# EAGLE schematic circuito_tesi (EAGLE 9.6.2)
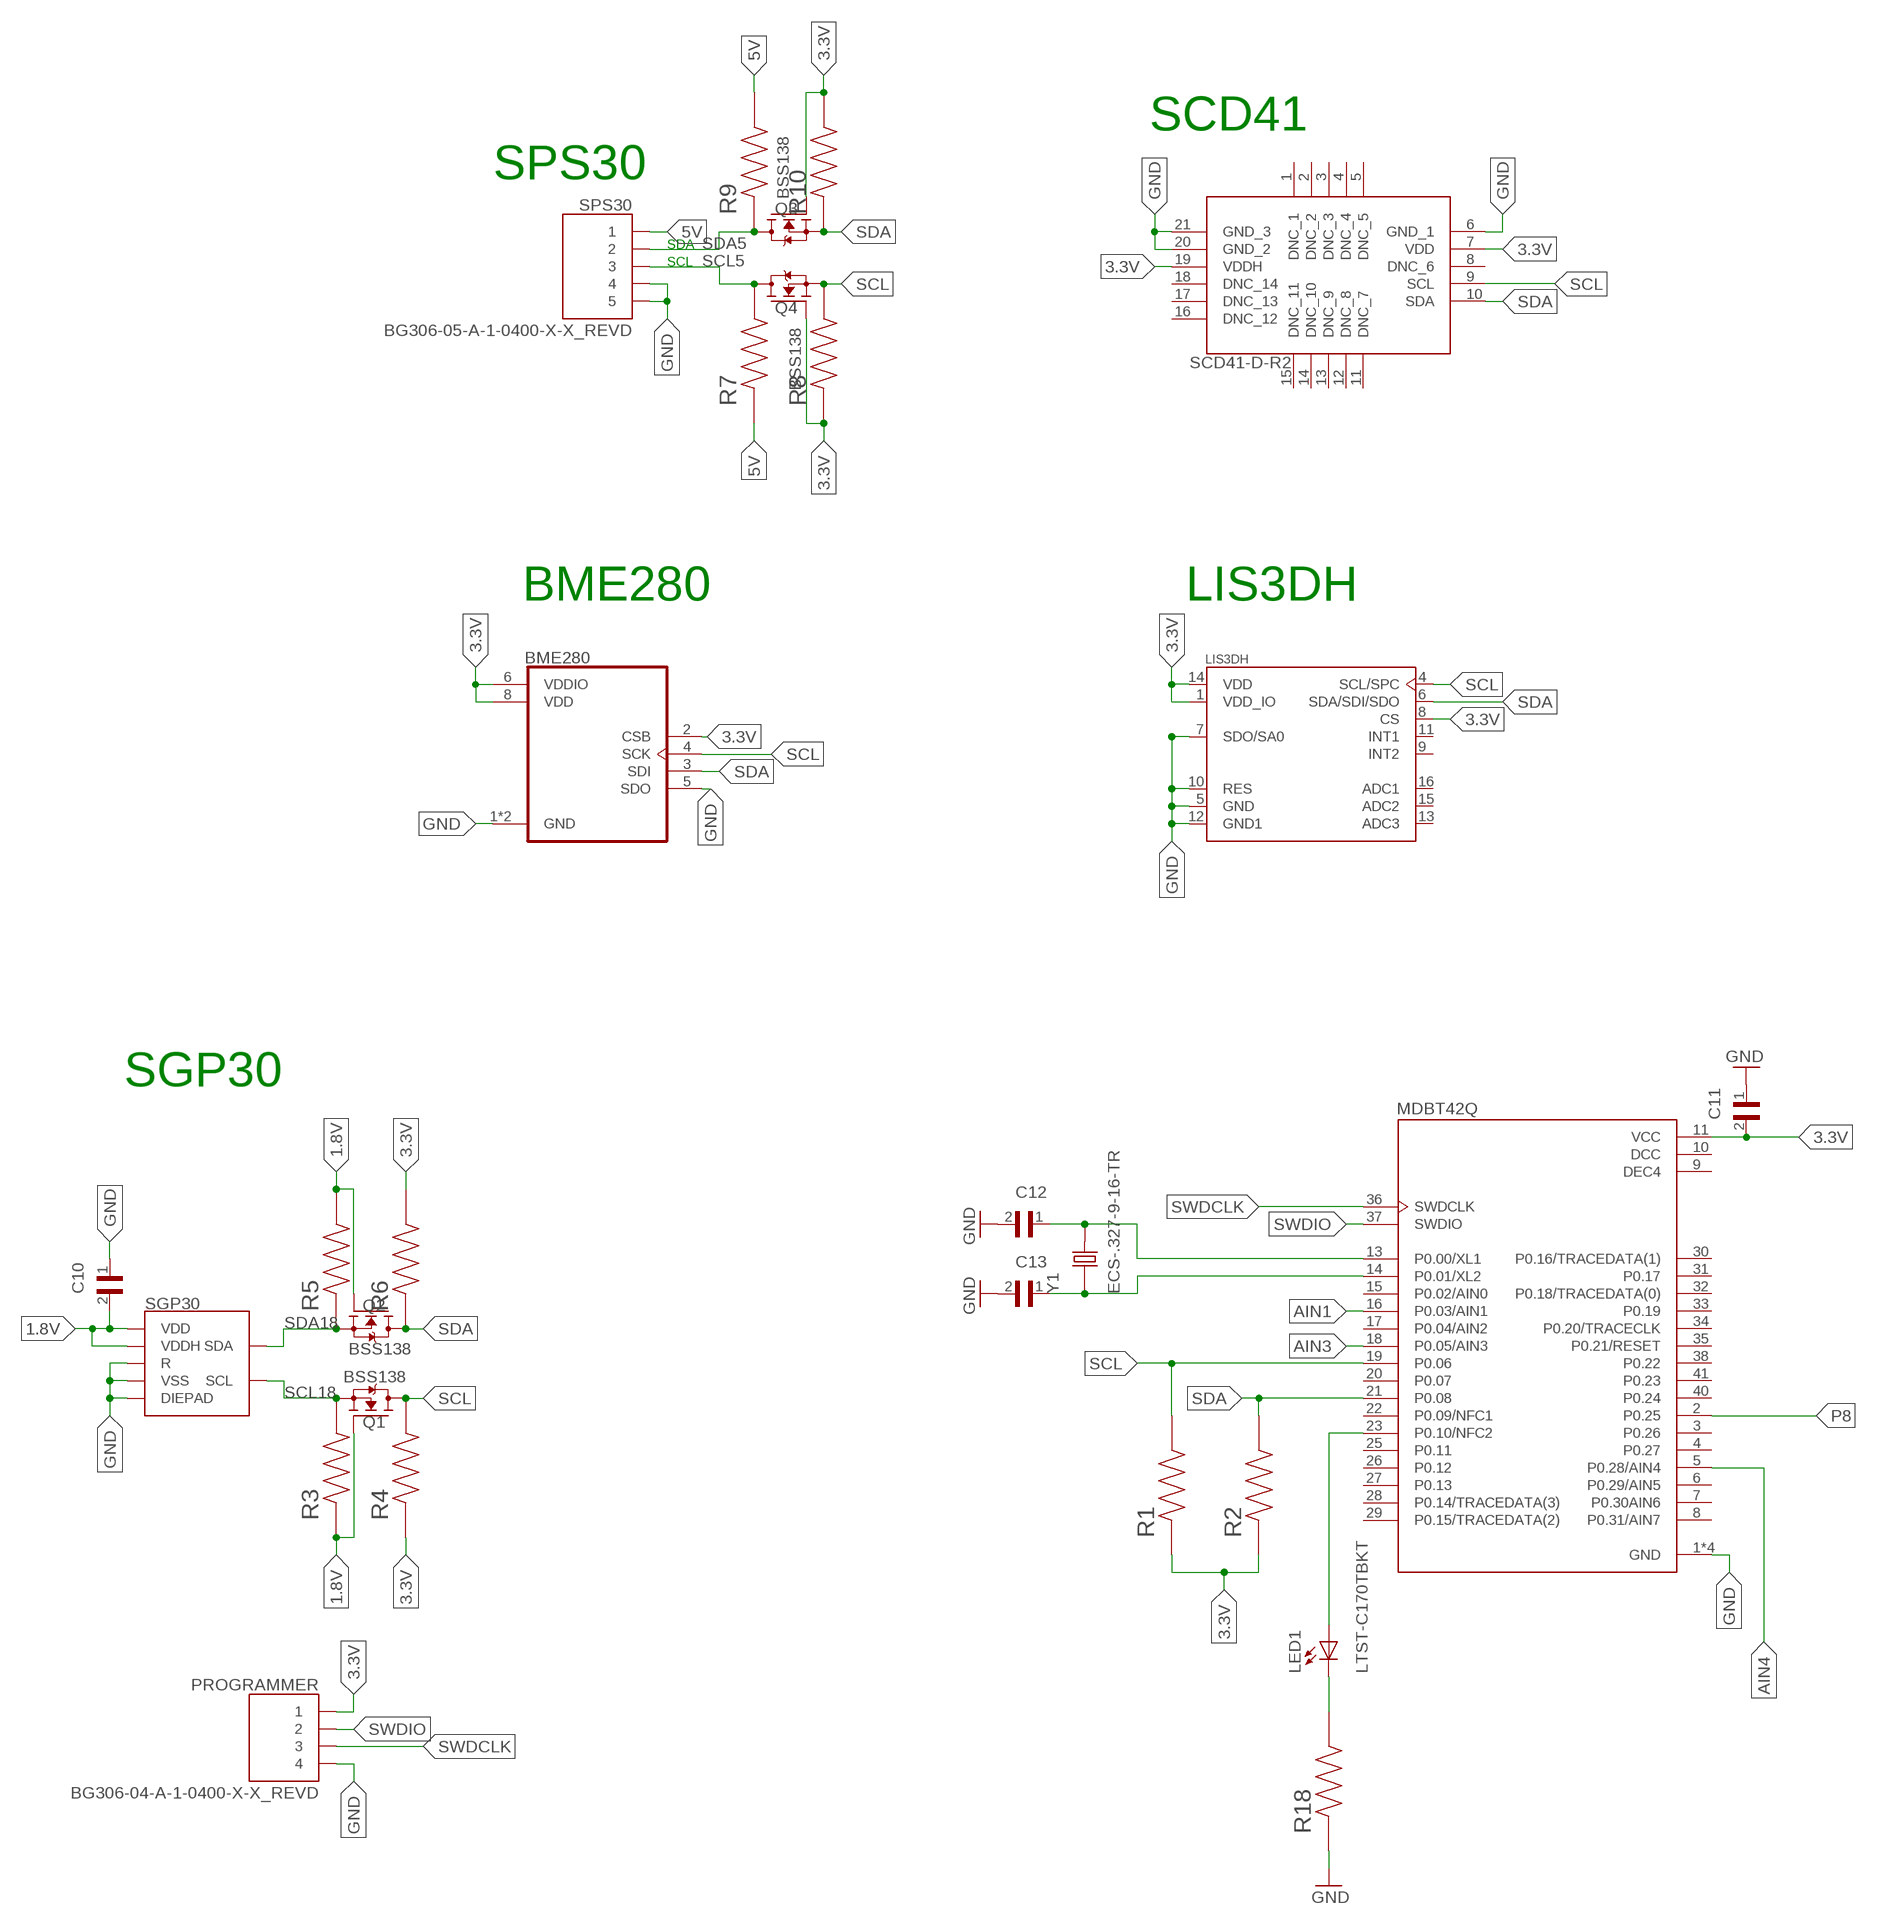
[diagram p0: schematic, sheet 1, part 1 of 2]
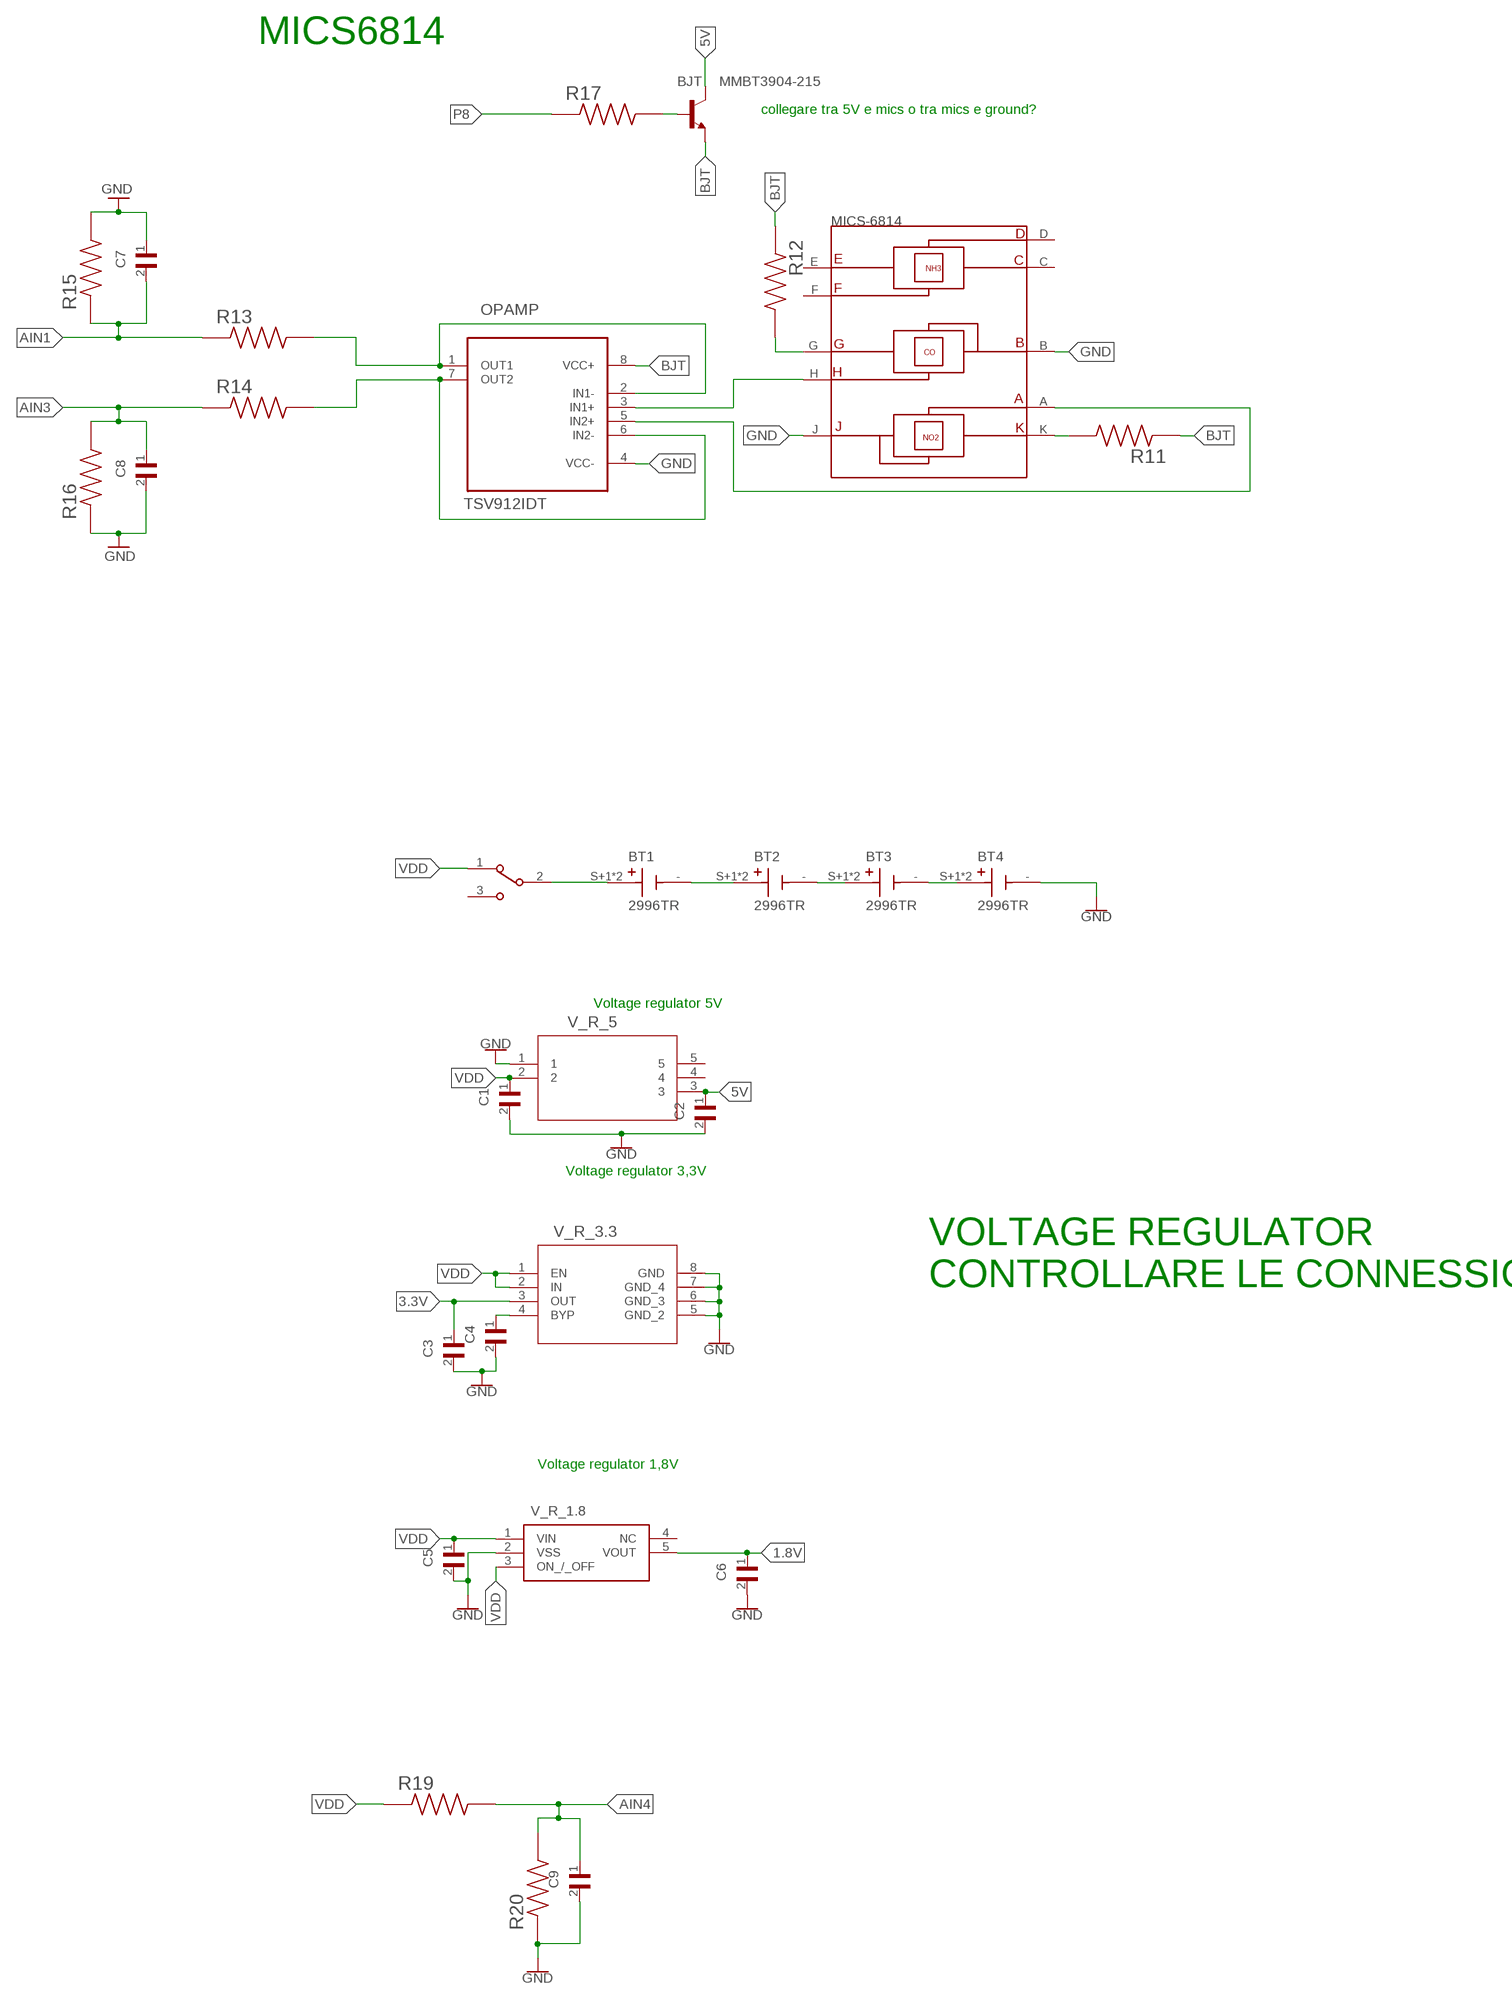
[diagram p1: schematic, sheet 1, part 2 of 2]

## Parts
BJT  MMBT3904-215  [SOT95P230X110-3N]
BT1  2996TR  [BAT_2996TR]
BT2  2996TR  [BAT_2996TR]
BT3  2996TR  [BAT_2996TR]
BT4  2996TR  [BAT_2996TR]
C1  C0402H102J5GACTU  [CAPC1005X55N]
C2  C0402H102J5GACTU  [CAPC1005X55N]
C3  C0402H102J5GACTU  [CAPC1005X55N]
C4  C0402H102J5GACTU  [CAPC1005X55N]
C5  C0402H102J5GACTU  [CAPC1005X55N]
C6  C0402H102J5GACTU  [CAPC1005X55N]
C7  C0402H102J5GACTU  [CAPC1005X55N]
C8  C0402H102J5GACTU  [CAPC1005X55N]
C9  C0402H102J5GACTU  [CAPC1005X55N]
C10  C0402H102J5GACTU  [CAPC1005X55N]
C11  C0402H102J5GACTU  [CAPC1005X55N]
C12  C0402H102J5GACTU  [CAPC1005X55N]
C13  C0402H102J5GACTU  [CAPC1005X55N]
IC1  SCD41-D-R2  [SCD41DR2]
LED1  LTST-C170TBKT  [DIOC200X125X110]
MDBT42Q  317030213  [XCVR_317030213]
OPAMP  TSV912IDT  [SOIC127P600X175-8N]
PROGRAMMER  BG306-04-A-1-0400-X-X_REVD  [GCT_BG306-04-A-1-0400-X-X_REVD]
Q1  BSS138  [SOT95P240X111-3N]
Q2  BSS138  [SOT95P240X111-3N]
Q3  BSS138  [SOT95P240X111-3N]
Q4  BSS138  [SOT95P240X111-3N]
R1  8-1879333-9  [RESC1005X35N]
R2  8-1879333-9  [RESC1005X35N]
R3  8-1879333-9  [RESC1005X35N]
R4  8-1879333-9  [RESC1005X35N]
R5  8-1879333-9  [RESC1005X35N]
R6  8-1879333-9  [RESC1005X35N]
R7  8-1879333-9  [RESC1005X35N]
R8  8-1879333-9  [RESC1005X35N]
R9  8-1879333-9  [RESC1005X35N]
R10  8-1879333-9  [RESC1005X35N]
R11  8-1879333-9  [RESC1005X35N]
R12  8-1879333-9  [RESC1005X35N]
R13  8-1879333-9  [RESC1005X35N]
R14  8-1879333-9  [RESC1005X35N]
R15  8-1879333-9  [RESC1005X35N]
R16  8-1879333-9  [RESC1005X35N]
R17  8-1879333-9  [RESC1005X35N]
R18  8-1879333-9  [RESC1005X35N]
R19  8-1879333-9  [RESC1005X35N]
R20  8-1879333-9  [RESC1005X35N]
S1  EG1213  [SW_EG1213]
SGP30  SGP30  [SGP30]
SPS30  BG306-05-A-1-0400-X-X_REVD  [GCT_BG306-05-A-1-0400-X-X_REVD]
U3  MICS-6814  [SENSOR_MICS-6814]
U6  BME280  [PSON65P250X250X100-8N]
U7  LIS3DH  [PQFN50P300X300X100-16N]
V_R_1.8  S-1318D18-M5T1U4  [SOT95P275X130-5N]
V_R_3.3  MIC5219-3.3YMMMSOP-8LD-PL-1_MCH  [MSOP-8LD-PL-1_MCH]
V_R_5  MC78LC50NTRGTSOT23-5_ONS  [TSOT23-5_ONS]
Y1  ECS-.327-9-16-TR  [XTAL_ECS-.327-9-16-TR]

## Nets
1.8V: C6.1 C10.2 Q1.1(G) Q2.1(G) R3.1 R5.2 SGP30.1(VDD) SGP30.5(VDDH) V_R_1.8.5(VOUT)
3.3V: C3.1 C11.2 IC1.7(VDD) IC1.19(VDDH) MDBT42Q.11(VCC) PROGRAMMER.1 Q3.1(G) Q4.1(G) R1.1 R2.1 R4.1 R6.2 R8.1 R10.2 U6.2(CSB) U6.6(VDDIO) U6.8(VDD) U7.1(VDD_IO) U7.8(CS) U7.14(VDD) V_R_3.3.3(OUT)
5V: BJT.3(C) C2.1 R7.1 R9.2 SPS30.1 V_R_5.3
AIN1: C7.2 MDBT42Q.16(P0.03/AIN1) R13.1 R15.1
AIN3: C8.1 MDBT42Q.18(P0.05/AIN3) R14.1 R16.2
AIN4: C9.1 MDBT42Q.5(P0.28/AIN4) R19.2 R20.2
BJT: BJT.2(E) OPAMP.8(VCC+) R11.1 R12.1
GND: BT4.- C1.2 C2.2 C3.2 C4.2 C5.2 C6.2 C7.1 C8.2 C9.2 C10.1 C11.1 C12.2 C13.2 IC1.6(GND_1) IC1.20(GND_2) IC1.21(GND_3) MDBT42Q.1(GND) MDBT42Q.12(GND) MDBT42Q.24(GND) MDBT42Q.39(GND) OPAMP.4(VCC-) PROGRAMMER.4 R15.2 R16.1 R18.1 R20.1 SGP30.2(VSS) SGP30.4(R) SGP30.DIEPAD SPS30.4 SPS30.5 U3.B(RH1/RS1_RED) U3.J(RH1/RS1_OX) U6.1(GND) U6.5(SDO) U6.7(GND) U7.5(GND) U7.7(SDO/SA0) U7.10(RES) U7.12(GND1) V_R_1.8.2(VSS) V_R_3.3.5(GND_2) V_R_3.3.6(GND_3) V_R_3.3.7(GND_4) V_R_3.3.8(GND) V_R_5.1
LED: LED1.+ MDBT42Q.23(P0.10/NFC2)
N$2: BT1.- BT2.S+1(+) BT2.S+2(+)
N$4: BT2.- BT3.S+1(+) BT3.S+2(+)
N$6: OPAMP.5(IN2+) U3.A(RS2)
N$7: OPAMP.6(IN2-) OPAMP.7(OUT2) R14.2
N$8: OPAMP.1(OUT1) OPAMP.2(IN1-) R13.2
N$9: LED1.- R18.2
N$10: OPAMP.3(IN1+) U3.H(RS2_RED)
N$11: R12.2 U3.G(RH2_RED)
N$13: R11.2 U3.K(RH2_OX)
N$14: C4.1 V_R_3.3.4(BYP)
N$15: BJT.1(B) R17.2
N$17: C12.1 MDBT42Q.13(P0.00/XL1) Y1.2
N$18: C13.1 MDBT42Q.14(P0.01/XL2) Y1.1
N$25: BT3.- BT4.S+1(+) BT4.S+2(+)
N$27: BT1.S+1(+) BT1.S+2(+) S1.2
P8: MDBT42Q.2(P0.25) R17.1
SCL: IC1.9(SCL) MDBT42Q.19(P0.06) Q1.3(D) Q4.2(S) R1.2 R4.2 R8.2 U6.4(SCK) U7.4(SCL/SPC)
SCL5: Q4.3(D) R7.2 SPS30.3
SCL18: Q1.2(S) R3.2 SGP30.6(SCL)
SDA: IC1.10(SDA) MDBT42Q.21(P0.08) Q2.3(D) Q3.2(S) R2.2 R6.1 R10.1 U6.3(SDI) U7.6(SDA/SDI/SDO)
SDA5: Q3.3(D) R9.1 SPS30.2
SDA18: Q2.2(S) R5.1 SGP30.3(SDA)
SWDCLK: MDBT42Q.36(SWDCLK) PROGRAMMER.3
SWDIO: MDBT42Q.37(SWDIO) PROGRAMMER.2
VDD: C1.1 C5.1 R19.1 S1.1 V_R_1.8.1(VIN) V_R_1.8.3(ON_/_OFF) V_R_3.3.1(EN) V_R_3.3.2(IN) V_R_5.2
Unconnected: IC1.1(DNC_1) IC1.2(DNC_2) IC1.3(DNC_3) IC1.4(DNC_4) IC1.5(DNC_5) IC1.8(DNC_6) IC1.11(DNC_7) IC1.12(DNC_8) IC1.13(DNC_9) IC1.14(DNC_10) IC1.15(DNC_11) IC1.16(DNC_12) IC1.17(DNC_13) IC1.18(DNC_14) MDBT42Q.3(P0.26) MDBT42Q.4(P0.27) MDBT42Q.6(P0.29/AIN5) MDBT42Q.7(P0.30AIN6) MDBT42Q.8(P0.31/AIN7) MDBT42Q.15(P0.02/AIN0) MDBT42Q.17(P0.04/AIN2) MDBT42Q.20(P0.07) MDBT42Q.22(P0.09/NFC1) MDBT42Q.25(P0.11) MDBT42Q.26(P0.12) MDBT42Q.27(P0.13) MDBT42Q.28(P0.14/TRACEDATA(3)) MDBT42Q.29(P0.15/TRACEDATA(2)) MDBT42Q.30(P0.16/TRACEDATA(1)) MDBT42Q.31(P0.17) MDBT42Q.32(P0.18/TRACEDATA(0)) MDBT42Q.33(P0.19) MDBT42Q.34(P0.20/TRACECLK) MDBT42Q.35(P0.21/RESET) MDBT42Q.38(P0.22) MDBT42Q.40(P0.24) MDBT42Q.41(P0.23) S1.3 U3.C(RH1_NH3) U3.D(RS1_NH3) U3.E(RH2_NH3) U3.F(RS2_NH3) U7.9(INT2) U7.11(INT1) U7.13(ADC3) U7.15(ADC2) U7.16(ADC1) V_R_1.8.4(NC) V_R_5.4 V_R_5.5

## Notes on the sheet
- MICS6814
- collegare tra 5V e mics o tra mics e ground?
- SCD41
- SPS30
- SDA
- SCL
- BME280 | LIS3DH
- Voltage regulator 5V
- SGP30
- Voltage regulator 3,3V
- VOLTAGE REGULATOR
  CONTROLLARE LE CONNESSIONI
- Voltage regulator 1,8V

## Power pins joined to a net without a drawn wire
DCC: MDBT42Q.10(DCC)
DEC4: MDBT42Q.9(DEC4)

## Library data of the parts
BJT = BJT_TO-236:MMBT3904-215: MMBT3904 series 40V 200mA SOT23 NPN Switching Transistor; DESCRIPTION: Bipolar (BJT) Transistor NPN 40 V 200 mA 300MHz 250 mW Surface Mount TO-236AB; DIGI-KEY_PART_NUMBER: 1727-4044-2-ND; MF: Nexperia USA; MP: MMBT3904,215; PACKAGE: SOT23-3 Nexperia USA Inc.; PURCHASE-URL: https://pricing.snapeda.com/search/part/MMBT3904,215/?ref=eda
BT1-BT4 = Battery_holder:2996TR: Battery Retainer Coin, 11.6mm 1 Cell SMD (SMT) Tab; DESCRIPTION: SMT Holder for 11.6mm Cell-Tin Nickel Plated on T&R; DIGI-KEY_PART_NUMBER: 36-2996TR-ND; MF: Keystone Electronics; MP: 2996TR; PACKAGE: None; PURCHASE-URL: https://pricing.snapeda.com/search/part/2996TR/?ref=eda
C1-C13 = Condensatore_case_0402:C0402H102J5GACTU: CAPACITOR, NP0, 0402, 50V, 1NF; Capacitance:1000pF; Capacitance Tolerance:± 5%; Dielectric Characteristic:C0G / NP0; Voltage Rating:50V; Capacitor Case Style:0402; Operating Temperature Range:-55°C to +200°C; SVHC:No SVHC (19-Dec-2011); Capacitor Mounting:SMD Check availability <https://pricing.snapeda.com/parts/C0402H102J5GACTU/KEMET/view-part?ref=eda>; AVAILABILITY: Not in stock; DESCRIPTION: CAPACITOR, NP0, 0402, 50V, 1NF; Capacitance:1000pF; Capacitance Tolerance:± 5%; Dielectric Characteristic:C0G / NP0; Voltage Rating:50V; Capacitor Case Style:0402; Operating Temperature Range:-55°C to +200°C; SVHC:No SVHC (19-Dec-2011); Capacitor Mounting:SMD; MF: KEMET; MP: C0402H102J5GACTU; PACKAGE: 0402 KEMET; PRICE: None
IC1 = SCD41-R2_unofficial:SCD41-D-R2: Air Quality Sensor CO2 Sensor 2.5V/3.3V/5V 20-Pin SMD EP Source: Datasheet <https://cz.mouser.com/datasheet/2/682/Sensirion_CO2_Sensors_SCD4x_Datasheet-2010009.pdf>; ARROW_PART_NUMBER: SCD41-D-R2; ARROW_PRICE-STOCK: https://www.arrow.com/en/products/scd41-d-r2/sensirion-ag?region=nac; DESCRIPTION: Air Quality Sensor CO2 Sensor 2.5V/3.3V/5V 20-Pin SMD EP; HEIGHT: 6.8mm; MANUFACTURER_NAME: Sensirion; MANUFACTURER_PART_NUMBER: SCD41-D-R2; MOUSER_PART_NUMBER: 403-SCD41-D-R2; MOUSER_PRICE-STOCK: https://www.mouser.co.uk/ProductDetail/Sensirion/SCD41-D-R2?qs=HBWAp0VN4Ri4o7ei4T3s0g%3D%3D
LED1 = LED_0805:LTST-C170TBKT: Green 2 x 1.25 x 1.1 mm 130° Water Clear 35 mcd 2 V Surface Mount LED; DESCRIPTION: LED Low-Power Uni-Color Blue 468nm 2-Pin Chip LED T/R; MF: Lite-On Electronics; MP: LTST-C170TBKT; PACKAGE: None; PURCHASE-URL: https://pricing.snapeda.com/search/part/LTST-C170TBKT/?ref=eda
MDBT42Q = Raytac_nRF52:317030213: Mdbt42q Nrf52832 Based BLE Module; DESCRIPTION: Bluetooth Bluetooth v4.2 Transceiver Module 2.4GHz Integrated, Chip Surface Mount; DIGI-KEY_PART_NUMBER: 1597-1434-ND; MF: Seeed Technology; MP: 317030213; PACKAGE: SMD-41 Seeed Studio; PURCHASE-URL: https://pricing.snapeda.com/search/part/317030213/?ref=eda
OPAMP = Opamp_SMD:TSV912IDT: operational amplifiers Check availability <https://pricing.snapeda.com/parts/TSV912IDT/STMicroelectronics/view-part?ref=eda>; AVAILABILITY: In Stock; DESCRIPTION: General Purpose Amplifier 2 Circuit Rail-to-Rail 8-SOIC; MF: STMicroelectronics; MP: TSV912IDT; PACKAGE: SOIC-8 STMicroelectronics; PRICE: None; PURCHASE-URL: https://pricing.snapeda.com/search/part/TSV912IDT/?ref=eda
PROGRAMMER = Connet_6_BG306-04-A-1-0400-X-X_REVD:BG306-04-A-1-0400-X-X_REVD: 2.54mm Pitch Pin Socket,Single Row Vertical, Top Entry, Surface Mount, Natural LCP; DESCRIPTION: 4 Position Receptacle Connector 0.100 (2.54mm) Surface Mount Gold; DIGI-KEY_PART_NUMBER: 2073-BG306-04-A-1-0400-L-BTR-ND; MF: Global Connector Technology; MP: BG306-04-A-1-0400-L-B; PACKAGE: None; PURCHASE-URL: https://pricing.snapeda.com/search/part/BG306-04-A-1-0400-L-B/?ref=eda
Q1-Q4 = BSS138:BSS138: N-Channel 50V 220mA (Ta) 360mW (Ta) Surface Mount SOT-23-3; DESCRIPTION: N-Channel 50 V 200mA (Ta) 225mW (Ta) Surface Mount SOT-23-3 (TO-236); DIGI-KEY_PART_NUMBER: BSS138TR-ND; MF: ON Semiconductor; MP: BSS138; PACKAGE: SOT-23 ON; PURCHASE-URL: https://pricing.snapeda.com/search/part/BSS138/?ref=eda
R1-R20 = Resistenza_case_0402:8-1879333-9: Precision Thin Film Smnt Resistor 0402 Case 160kOhm +/-0.1%.063W +/-25ppm/C Check availability <https://pricing.snapeda.com/parts/8-1879333-9/TE%20Connectivity/view-part?ref=eda>; AVAILABILITY: In Stock; COMMENT: 8-1879333-9; DESCRIPTION: Precision Thin Film Smnt Resistor 0402 Case 160kOhm +/-0.1%.063W +/-25ppm/C; MF: TE Connectivity; MP: 8-1879333-9; PACKAGE: None; PRICE: None; PURCHASE-URL: https://pricing.snapeda.com/search/part/8-1879333-9/?ref=eda
S1 = switch_TH_HO:EG1213: EG Series SPDT On-On Right Angle Through Hole Slide Switch; DESCRIPTION: Slide Switch SPDT Through Hole, Right Angle; DIGI-KEY_PART_NUMBER: EG1906-ND; MF: E-Switch; MP: EG1213; PACKAGE: None; PURCHASE-URL: https://pricing.snapeda.com/search/part/EG1213/?ref=eda
SGP30 = SGP30:SGP30: The SGP30 is a digital multi-pixel gas sensor designed for easy integration into air purifier, demand-controlled ventilation, and IoT applications. Check availability <https://pricing.snapeda.com/parts/SGP30/Sensirion%20AG/view-part?ref=eda>; AVAILABILITY: In Stock; DESCRIPTION: SGP30, SHTC1 Air Quality, Humidity, Temperature Sensor Arduino Platform Evaluation Expansion Board; MF: Sensirion AG; MP: SGP30; PACKAGE: None; PRICE: None; PURCHASE-URL: https://pricing.snapeda.com/search/part/SGP30/?ref=eda
SPS30 = Connet_5_BG306-05-A-1-0400-X-X_REVD:BG306-05-A-1-0400-X-X_REVD: 2.54mm Pitch Pin Socket,Single Row Vertical, Top Entry, Surface Mount, Natural LCP; DESCRIPTION: 5 Position Receptacle Connector 0.100 (2.54mm) Surface Mount Gold; DIGI-KEY_PART_NUMBER: 2073-BG306-05-A-1-0400-L-BTR-ND; MF: Global Connector Technology; MP: BG306-05-A-1-0400-L-B; PACKAGE: None; PURCHASE-URL: https://pricing.snapeda.com/search/part/BG306-05-A-1-0400-L-B/?ref=eda
U3 = MICS-6814:MICS-6814: Three gas SMD NH3, CO and NO2 Check availability <https://pricing.snapeda.com/parts/MICS-6814/MikroElektronika/view-part?ref=eda>; AVAILABILITY: Not in stock; DESCRIPTION: MiCS-6814 Air Quality Sensor mikroBUS™ Click™ Platform Evaluation Expansion Board; MF: MikroElektronika; MP: MICS-6814; PACKAGE: None; PRICE: None
U6 = BME280:BME280: DIGITAL HUMIDITY, PRESSURE AND TEMPERATURE SENSOR * Digital interface I²C (up to 3.4 MHz) and SPI (3 and 4 wire, up to 10 MHz)* Supply voltage VDD main supply voltage range: 1.71 V to 3.6 V*VDDIO interface voltage range: 1.2 V to 3.6 V Operating range -40…+85 °C, 0…100 % rel. humidity, 300…1100 hPa The library has been designed by Richard Magdycz <https://www.facebook.com/groups/eaglecadsoftUK> Check availability <https://pricing.snapeda.com/parts/BME280/Bosch/view-part?ref=eda>; AVAILABILITY: In Stock; DESCRIPTION: Board Mount Humidity Sensors MEMS humidity, pressure and temperature sensor; MF: Bosch; MP: BME280; PACKAGE: LGA-8 Bosch; PRICE: None; PURCHASE-URL: https://pricing.snapeda.com/search/part/BME280/?ref=eda
U7 = LIS3DH:LIS3DH: MEMS digital output motion sensor ultra low-power high performance 3-axes "nano" accelerometer; DESCRIPTION: Accelerometer X, Y, Z Axis ±2g, 4g, 8g, 16g 0.5Hz ~ 625Hz 16-LGA (3x3); DIGI-KEY_PART_NUMBER: 497-10610-ND; MF: STMicroelectronics; MP: LIS3DH; PACKAGE: LGA-16 STMicroelectronics; PURCHASE-URL: https://pricing.snapeda.com/search/part/LIS3DH/?ref=eda
V_R_1.8 = VOLT_REG_1.8_SOT-23-5:S-1318D18-M5T1U4: IC REG LINEAR 1.8V 100MA SOT23-5 Source: Datasheet <https://www.ablic.com/en/doc/datasheet/voltage_regulator/S1318_E.pdf>; DESCRIPTION: IC REG LINEAR 1.8V 100MA SOT23-5; HEIGHT: 1.3mm; MANUFACTURER_NAME: ABLIC Inc.; MANUFACTURER_PART_NUMBER: S-1318D18-M5T1U4; MOUSER_PART_NUMBER: 628-S-1318D18-M5T1U4; MOUSER_PRICE-STOCK: https://www.mouser.co.uk/ProductDetail/ABLIC/S-1318D18-M5T1U4/?qs=bZr6mbWTK5mVILZBDijY2w%3D%3D
V_R_3.3 = Volt_Reg_3.3_8MSOP:MIC5219-3.3YMM; COPYRIGHT: Copyright (C) 2022 Ultra Librarian. All rights reserved.; DIGI-KEY_PART_NUMBER_1: 576-1827-5-ND; MANUFACTURER_PART_NUMBER: MIC5219-3.3YMM; MFR_NAME: Microchip
V_R_5 = VOLT_REG_5V_SOT-23-5:MC78LC50NTRG; COPYRIGHT: Copyright (C) 2022 Ultra Librarian. All rights reserved.; DIGI-KEY_PART_NUMBER_1: 2156-MC78LC50NTRG-OS-ND; DIGI-KEY_PART_NUMBER_2: =MC78LC50NTRG; DIGI-KEY_PART_NUMBER_3: MC78LC50NTRGOSCT-ND; DIGI-KEY_PART_NUMBER_4: MC78LC50NTRGOSDKR-ND; DIGI-KEY_PART_NUMBER_5: MC78LC50NTRGOSTR-ND; MANUFACTURER_PART_NUMBER: MC78LC50NTRG; MFR_NAME: onsemi
Y1 = Crystal-ECS-.327-9-16-TR:ECS-.327-9-16-TR: SMD Tuning Fork Crystal; DESCRIPTION: 32.768 kHz ±20ppm Crystal 9pF 90 kOhms 2-SMD, No Lead; DIGI-KEY_PART_NUMBER: XC2132TR-ND; MF: ECS Inc.; MP: ECS-.327-9-16-TR; PACKAGE: SMD-2 ECS International; PURCHASE-URL: https://pricing.snapeda.com/search/part/ECS-.327-9-16-TR/?ref=eda